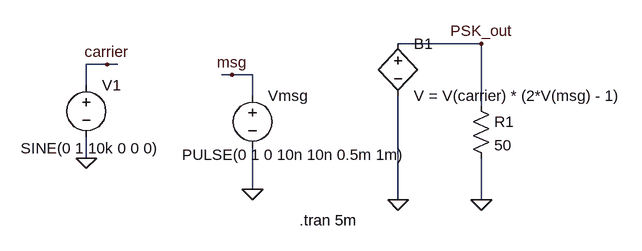
[diagram p0: schematic exp10_bpsk.asc]
exp10_bpsk.asc, the LTspice schematic file:
Version 4.1
SHEET 1 880 680
WIRE 384 16 256 16
WIRE -192 48 -224 48
WIRE -176 48 -192 48
WIRE 0 64 -16 64
WIRE 32 64 0 64
WIRE -224 80 -224 48
WIRE 32 96 32 64
WIRE 384 112 384 16
WIRE -224 192 -224 160
WIRE 32 240 32 176
WIRE 256 256 256 96
WIRE 384 256 384 192
FLAG -224 192 0
FLAG -192 48 carrier
FLAG 32 240 0
FLAG 0 64 msg
FLAG 256 256 0
FLAG 384 256 0
FLAG 384 16 PSK_out
SYMBOL voltage -224 64 R0
WINDOW 3 -101 113 Left 2
WINDOW 123 0 0 Left 0
WINDOW 39 0 0 Left 0
SYMATTR InstName V1
SYMATTR Value SINE(0 1 10k 0 0 0)
SYMBOL voltage 32 80 R0
WINDOW 3 -109 107 Left 2
WINDOW 123 0 0 Left 0
WINDOW 39 0 0 Left 0
SYMATTR InstName Vmsg
SYMATTR Value PULSE(0 1 0 10n 10n 0.5m 1m)
SYMBOL bv 256 0 R0
SYMATTR InstName B1
SYMATTR Value V = V(carrier) * (2*V(msg) - 1)
SYMBOL res 368 96 R0
SYMATTR InstName R1
SYMATTR Value 50
TEXT 104 288 Left 2 !.tran 5m

The netlist it stands for:
* exp10_bpsk.asc
V1 carrier 0 SINE(0 1 10k 0 0 0)
Vmsg msg 0 PULSE(0 1 0 10n 10n 0.5m 1m)
B1 PSK_out 0 V = V(carrier) * (2*V(msg) - 1)
R1 PSK_out 0 50
.tran 5m
.backanno
.end